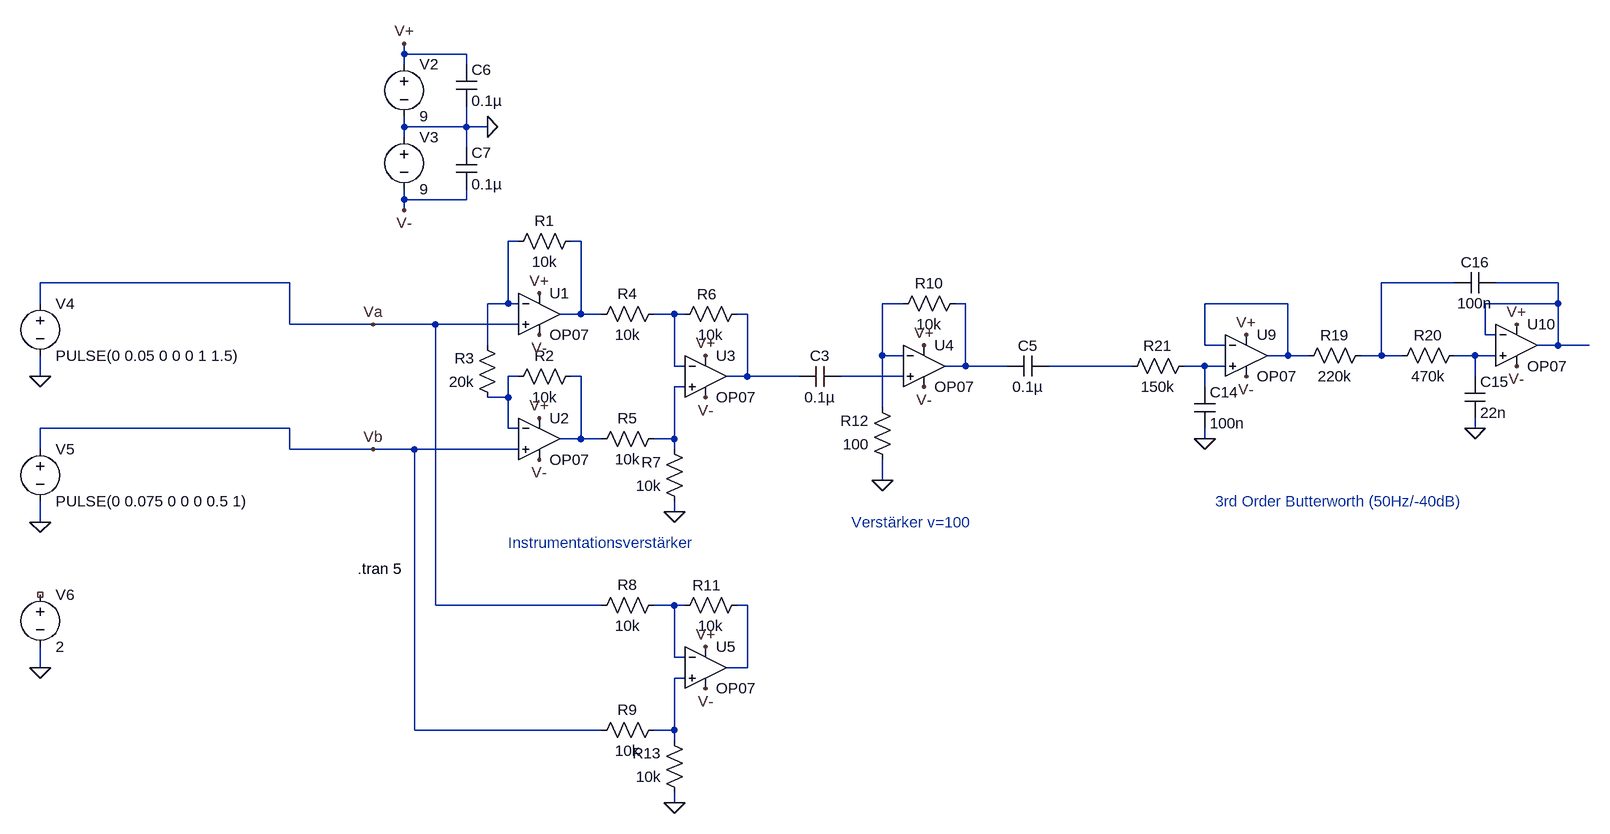
[diagram p0: schematic ekg_v3_switch.asc]
ekg_v3_switch.asc, the LTspice schematic file:
Version 4
SHEET 1 2260 1124
WIRE 432 -256 432 -272
WIRE 528 -256 432 -256
WIRE 432 -240 432 -256
WIRE 528 -240 528 -256
WIRE 432 -144 432 -160
WIRE 528 -144 528 -176
WIRE 528 -144 432 -144
WIRE 560 -144 528 -144
WIRE 432 -128 432 -144
WIRE 528 -112 528 -144
WIRE 432 -32 432 -48
WIRE 528 -32 528 -48
WIRE 528 -32 432 -32
WIRE 432 -16 432 -32
WIRE 608 32 592 32
WIRE 704 32 688 32
WIRE 256 96 -128 96
WIRE 2048 96 1936 96
WIRE 2208 96 2112 96
WIRE -128 128 -128 96
WIRE 592 128 592 32
WIRE 592 128 560 128
WIRE 608 128 592 128
WIRE 1200 128 1168 128
WIRE 1296 128 1280 128
WIRE 1792 128 1664 128
WIRE 2208 128 2208 96
WIRE 2208 128 2096 128
WIRE 704 144 704 32
WIRE 704 144 672 144
WIRE 736 144 704 144
WIRE 848 144 816 144
WIRE 864 144 848 144
WIRE 960 144 944 144
WIRE 256 160 256 96
WIRE 384 160 256 160
WIRE 480 160 384 160
WIRE 608 160 480 160
WIRE 2096 176 2096 128
WIRE 2112 176 2096 176
WIRE 560 192 560 128
WIRE 1664 192 1664 128
WIRE 1696 192 1664 192
WIRE 2208 192 2208 128
WIRE 2208 192 2176 192
WIRE 2256 192 2208 192
WIRE 1168 208 1168 128
WIRE 1200 208 1168 208
WIRE 1792 208 1792 128
WIRE 1792 208 1760 208
WIRE 1824 208 1792 208
WIRE 1936 208 1936 96
WIRE 1936 208 1904 208
WIRE 1968 208 1936 208
WIRE 2080 208 2048 208
WIRE 2112 208 2080 208
WIRE 848 224 848 144
WIRE 864 224 848 224
WIRE 1296 224 1296 128
WIRE 1296 224 1264 224
WIRE 1360 224 1296 224
WIRE 1552 224 1424 224
WIRE 1664 224 1632 224
WIRE 1696 224 1664 224
WIRE -128 240 -128 208
WIRE 608 240 592 240
WIRE 704 240 688 240
WIRE 960 240 960 144
WIRE 960 240 928 240
WIRE 1040 240 960 240
WIRE 1200 240 1104 240
WIRE 2080 240 2080 208
WIRE 864 256 848 256
WIRE 1664 256 1664 224
WIRE 592 272 592 240
WIRE 592 272 560 272
WIRE 1168 288 1168 208
WIRE 256 320 -128 320
WIRE 592 320 592 272
WIRE 608 320 592 320
WIRE 2080 320 2080 304
WIRE 704 336 704 240
WIRE 704 336 672 336
WIRE 736 336 704 336
WIRE 848 336 848 256
WIRE 848 336 816 336
WIRE 1664 336 1664 320
WIRE -128 352 -128 320
WIRE 256 352 256 320
WIRE 384 352 256 352
WIRE 448 352 384 352
WIRE 608 352 448 352
WIRE 848 352 848 336
WIRE 1168 400 1168 368
WIRE 848 448 848 432
WIRE -128 464 -128 432
WIRE 480 592 480 160
WIRE 736 592 480 592
WIRE 848 592 816 592
WIRE 864 592 848 592
WIRE 960 592 944 592
WIRE 848 672 848 592
WIRE 864 672 848 672
WIRE -128 688 -128 656
WIRE 960 688 960 592
WIRE 960 688 928 688
WIRE 864 704 848 704
WIRE 448 784 448 352
WIRE 736 784 448 784
WIRE 848 784 848 704
WIRE 848 784 816 784
WIRE 848 800 848 784
WIRE 848 896 848 880
FLAG 848 448 0
FLAG 432 -272 V+
FLAG 640 176 V-
FLAG 640 368 V-
FLAG 896 272 V-
FLAG 560 -144 0
FLAG 432 -16 V-
FLAG 640 112 V+
FLAG 896 208 V+
FLAG 640 304 V+
FLAG 1168 400 0
FLAG 1232 192 V+
FLAG 1232 256 V-
FLAG 384 160 Va
FLAG 384 352 Vb
FLAG 1664 336 0
FLAG 2080 320 0
FLAG 1728 176 V+
FLAG 2144 160 V+
FLAG 1728 240 V-
FLAG 2144 224 V-
FLAG -128 240 0
FLAG -128 464 0
FLAG -128 688 0
FLAG 848 896 0
FLAG 896 720 V-
FLAG 896 656 V+
SYMBOL OpAmps\\OP07 640 80 R0
SYMATTR InstName U1
SYMBOL OpAmps\\OP07 640 272 R0
SYMATTR InstName U2
SYMBOL OpAmps\\OP07 896 176 R0
SYMATTR InstName U3
SYMBOL res 704 224 R90
WINDOW 0 0 56 VBottom 2
WINDOW 3 32 56 VTop 2
SYMATTR InstName R2
SYMATTR Value 10k
SYMBOL res 704 16 R90
WINDOW 0 0 56 VBottom 2
WINDOW 3 32 56 VTop 2
SYMATTR InstName R1
SYMATTR Value 10k
SYMBOL res 576 288 R180
WINDOW 0 36 76 Left 2
WINDOW 3 36 40 Left 2
SYMATTR InstName R3
SYMATTR Value 20k
SYMBOL res 832 128 R90
WINDOW 0 0 56 VBottom 2
WINDOW 3 32 56 VTop 2
SYMATTR InstName R4
SYMATTR Value 10k
SYMBOL res 832 320 R90
WINDOW 0 0 56 VBottom 2
WINDOW 3 32 56 VTop 2
SYMATTR InstName R5
SYMATTR Value 10k
SYMBOL res 960 128 R90
WINDOW 0 1 62 VBottom 2
WINDOW 3 32 56 VTop 2
SYMATTR InstName R6
SYMATTR Value 10k
SYMBOL res 864 448 R180
WINDOW 0 36 76 Left 2
WINDOW 3 36 40 Left 2
SYMATTR InstName R7
SYMATTR Value 10k
SYMBOL voltage 432 -256 R0
WINDOW 123 0 0 Left 0
WINDOW 39 0 0 Left 0
SYMATTR InstName V2
SYMATTR Value 9
SYMBOL voltage 432 -144 R0
SYMATTR InstName V3
SYMATTR Value 9
SYMBOL OpAmps\\OP07 1232 160 R0
SYMATTR InstName U4
SYMBOL res 1296 112 R90
WINDOW 0 0 56 VBottom 2
WINDOW 3 32 56 VTop 2
SYMATTR InstName R10
SYMATTR Value 10k
SYMBOL res 1184 384 R180
WINDOW 0 36 76 Left 2
WINDOW 3 36 40 Left 2
SYMATTR InstName R12
SYMATTR Value 100
SYMBOL cap 1104 224 R90
WINDOW 0 0 32 VBottom 2
WINDOW 3 32 32 VTop 2
SYMATTR InstName C3
SYMATTR Value 0.1µ
SYMBOL cap 1424 208 R90
WINDOW 0 0 32 VBottom 2
WINDOW 3 32 32 VTop 2
SYMATTR InstName C5
SYMATTR Value 0.1µ
SYMBOL cap 512 -240 R0
SYMATTR InstName C6
SYMATTR Value 0.1µ
SYMBOL cap 512 -112 R0
SYMATTR InstName C7
SYMATTR Value 0.1µ
SYMBOL OpAmps\\OP07 1728 144 R0
SYMATTR InstName U9
SYMBOL cap 1648 256 R0
SYMATTR InstName C14
SYMATTR Value 100n
SYMBOL res 1920 192 R90
WINDOW 0 0 56 VBottom 2
WINDOW 3 32 56 VTop 2
SYMATTR InstName R19
SYMATTR Value 220k
SYMBOL res 2064 192 R90
WINDOW 0 0 56 VBottom 2
WINDOW 3 32 56 VTop 2
SYMATTR InstName R20
SYMATTR Value 470k
SYMBOL cap 2064 240 R0
SYMATTR InstName C15
SYMATTR Value 22n
SYMBOL OpAmps\\OP07 2144 128 R0
SYMATTR InstName U10
SYMBOL cap 2112 80 R90
WINDOW 0 0 32 VBottom 2
WINDOW 3 32 32 VTop 2
SYMATTR InstName C16
SYMATTR Value 100n
SYMBOL res 1648 208 R90
WINDOW 0 0 56 VBottom 2
WINDOW 3 32 56 VTop 2
SYMATTR InstName R21
SYMATTR Value 150k
SYMBOL voltage -128 112 R0
WINDOW 123 0 0 Left 0
WINDOW 39 0 0 Left 0
SYMATTR InstName V4
SYMATTR Value PULSE(0 0.05 0 0 0 1 1.5)
SYMBOL voltage -128 336 R0
WINDOW 123 0 0 Left 0
WINDOW 39 0 0 Left 0
SYMATTR InstName V5
SYMATTR Value PULSE(0 0.075 0 0 0 0.5 1)
SYMBOL voltage -128 560 R0
SYMATTR InstName V6
SYMATTR Value 2
SYMBOL OpAmps\\OP07 896 624 R0
SYMATTR InstName U5
SYMBOL res 832 576 R90
WINDOW 0 0 56 VBottom 2
WINDOW 3 32 56 VTop 2
SYMATTR InstName R8
SYMATTR Value 10k
SYMBOL res 832 768 R90
WINDOW 0 0 56 VBottom 2
WINDOW 3 32 56 VTop 2
SYMATTR InstName R9
SYMATTR Value 10k
SYMBOL res 960 576 R90
WINDOW 0 1 62 VBottom 2
WINDOW 3 32 56 VTop 2
SYMATTR InstName R11
SYMATTR Value 10k
SYMBOL res 864 896 R180
WINDOW 0 36 76 Left 2
WINDOW 3 36 40 Left 2
SYMATTR InstName R13
SYMATTR Value 10k
TEXT 592 496 Left 2 ;Instrumentationsverstärker
TEXT 360 536 Left 2 !.tran 5
TEXT 1120 464 Left 2 ;Verstärker v=100
TEXT 1680 432 Left 2 ;3rd Order Butterworth (50Hz/-40dB)

The netlist it stands for:
* ekg_v3_switch.asc
XU1 Va N001 V+ V- N002 LT1001  ; OP07, pins In+ In- V+ V- OUT
XU2 Vb N013 V+ V- N014 LT1001  ; OP07, pins In+ In- V+ V- OUT
XU3 N016 N008 V+ V- N009 LT1001  ; OP07, pins In+ In- V+ V- OUT
R2 N014 N013 10k
R1 N002 N001 10k
R3 N013 N001 20k
R4 N008 N002 10k
R5 N016 N014 10k
R6 N009 N008 10k
R7 0 N016 10k
V2 V+ 0 9
V3 0 V- 9
XU4 N015 N005 V+ V- N006 LT1001  ; OP07, pins In+ In- V+ V- OUT
R10 N006 N005 10k
R12 0 N005 100
C3 N015 N009 0.1µ
C5 N011 N006 0.1µ
C6 V+ 0 0.1µ
C7 0 V- 0.1µ
XU9 N012 N007 V+ V- N007 LT1001  ; OP07, pins In+ In- V+ V- OUT
C14 N012 0 100n
R19 N003 N007 220k
R20 N010 N003 470k
C15 N010 0 22n
XU10 N010 N004 V+ V- N004 LT1001  ; OP07, pins In+ In- V+ V- OUT
C16 N004 N003 100n
R21 N012 N011 150k
V4 Va 0 PULSE(0 0.05 0 0 0 1 1.5)
V5 Vb 0 PULSE(0 0.075 0 0 0 0.5 1)
V6 NC_01 0 2
XU5 N019 N017 V+ V- N018 LT1001  ; OP07, pins In+ In- V+ V- OUT
R8 N017 Va 10k
R9 N019 Vb 10k
R11 N018 N017 10k
R13 0 N019 10k
* Instrumentationsverstärker
.tran 5
* Verstärker v=100
* 3rd Order Butterworth (50Hz/-40dB)
.lib LTC.lib
.backanno
.end

* Results of the author's LTspice run, read from the files saved beside the schematic
* Operating Point, zero values left out:
*   V(v+) = 9 V
*   V(v-) = -9 V
*   I(V3) = -15.75 mA
*   I(V2) = -15.75 mA
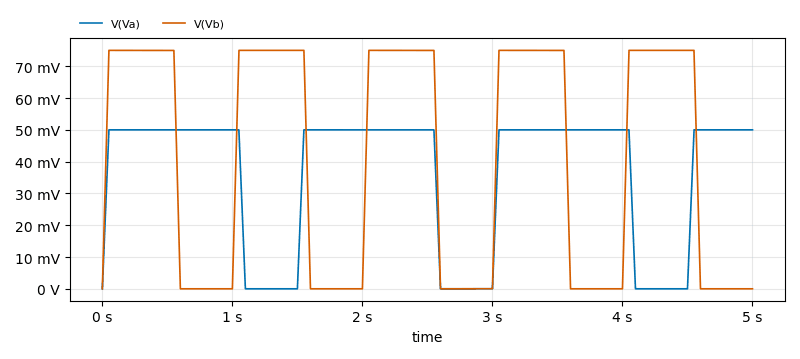
[diagram p1: Transient Analysis of ekg_v3_switch.asc, plotted from the saved traces]
* Transient Analysis, 1 run:
*   V(Va): min 0 V, max 50 mV, average 36.25 mV, rms 42.24 mV, last 50 mV
*   V(Vb): min 0 V, max 75 mV, average 41.25 mV, rms 54.78 mV, last 0 V